# EAGLE design master-board (EAGLE 8.6.0)
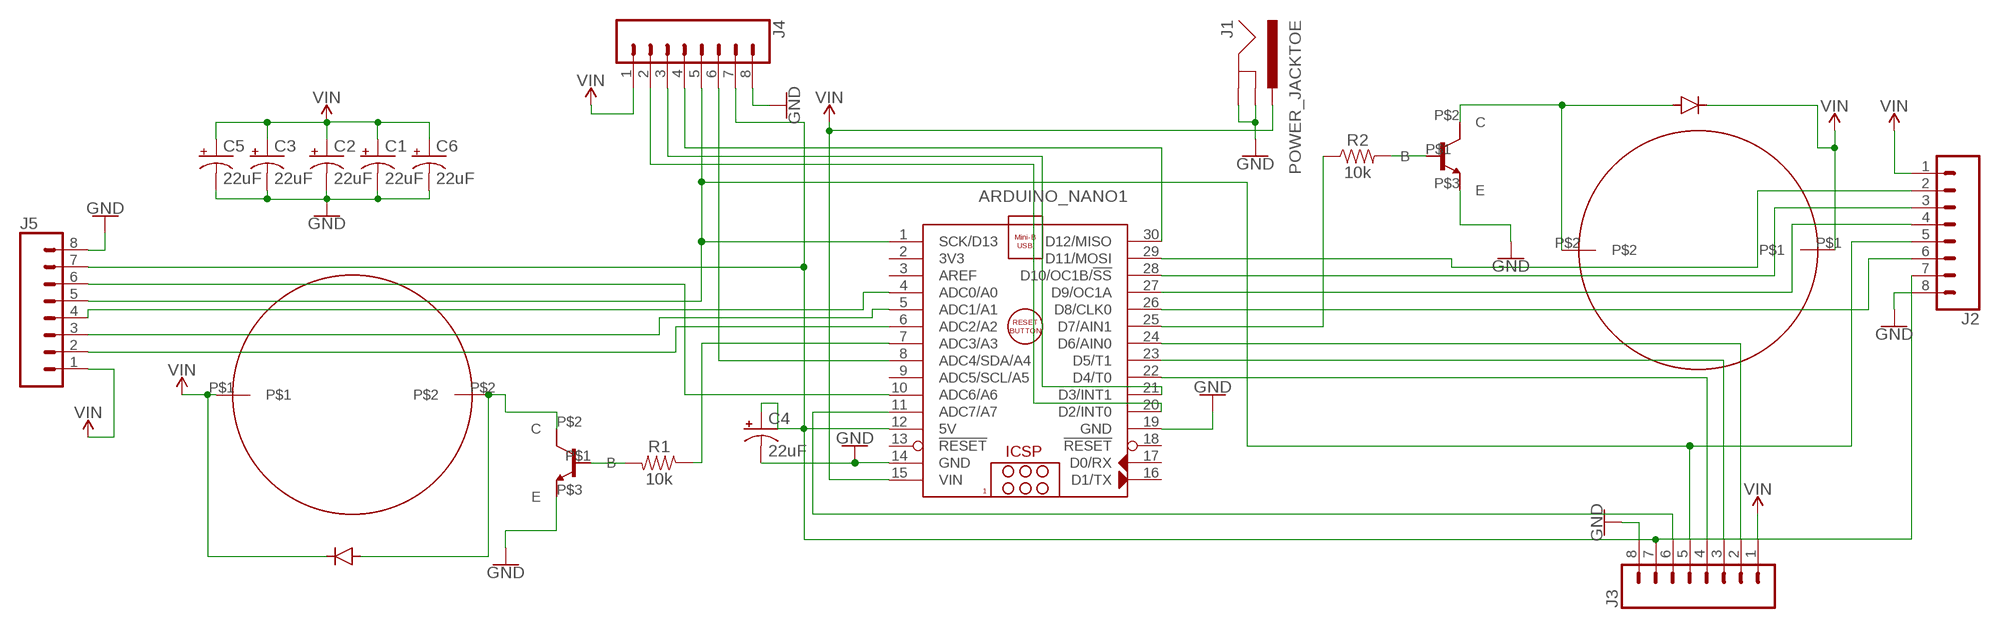
[diagram p0: schematic, sheet 1]

## Parts
ARDUINO_NANO1  ARDUINO_NANO  [ARDUINO_NANO]
C1  22uF  22UF-POLAR-PANASONIC_C-35V-20%  [PANASONIC_C]
C2  22uF  22UF-POLAR-PANASONIC_C-35V-20%  [PANASONIC_C]
C3  22uF  22UF-POLAR-PANASONIC_C-35V-20%  [PANASONIC_C]
C4  22uF  22UF-POLAR-PANASONIC_C-35V-20%  [PANASONIC_C]
C5  22uF  22UF-POLAR-PANASONIC_C-35V-20%  [PANASONIC_C]
C6  22uF  22UF-POLAR-PANASONIC_C-35V-20%  [PANASONIC_C]
J1  POWER_JACKTOE  [POWER_JACK_SMD_OVERPASTE_TOE]
J2  CONN_08"  [1X08]
J3  CONN_08"  [1X08]
J4  CONN_08"  [1X08]
J5  CONN_08"  [1X08]
R1  10k  10KOHM-0603-1/10W-1%  [0603]
R2  10k  10KOHM-0603-1/10W-1%  [0603]
U$1  AIYIMA-PUMP-A5F083  [A5F083]
U$2  AIYIMA-PUMP-A5F083  [A5F083]
U$3  IN4148  [IN4148]
U$4  IN4148  [IN4148]
U$5  TIP120-TO220  [TO220]
U$6  TIP120-TO220  [TO220]

## Nets
GND: ARDUINO_NANO1.14(GND) ARDUINO_NANO1.19(GND) C1.- C2.- C3.- C4.- C5.- C6.- J1.GND(GNDBREAK) J1.P$4(GND) J2.8 J3.8 J4.8 J5.8 U$5.P$3(E) U$6.P$3(E)
N$1: ARDUINO_NANO1.25(D7/AIN1) R2.1
N$2: R1.2 U$6.P$1(B)
N$3: ARDUINO_NANO1.22(D4/T0) J3.4
N$4: ARDUINO_NANO1.23(D5/T1) J3.3
N$5: U$1.P$2 U$3.P$2 U$6.P$2(C)
N$6: U$2.P$2 U$4.P$2 U$5.P$2(C)
N$7: R2.2 U$5.P$1(B)
N$8: ARDUINO_NANO1.21(D3/INT1) J4.3
N$9: ARDUINO_NANO1.24(D6/AIN0) J3.2
N$10: ARDUINO_NANO1.7(ADC3/A3) R1.1
N$11: ARDUINO_NANO1.8(ADC4/SDA/A4) J4.6
N$13: ARDUINO_NANO1.1(SCK/D13) J2.5 J3.5 J4.5 J5.5
N$14: ARDUINO_NANO1.10(ADC6/A6) J5.6
N$15: ARDUINO_NANO1.11(ADC7/A7) J3.6
N$16: ARDUINO_NANO1.20(D2/INT0) J4.2
N$18: ARDUINO_NANO1.30(D12/MISO) J4.4
N$20: ARDUINO_NANO1.12(5V) C4.+ J2.7 J3.7 J4.7 J5.7
N$22: ARDUINO_NANO1.26(D8/CLK0) J2.6
N$23: ARDUINO_NANO1.27(D9/OC1A) J2.4
N$24: ARDUINO_NANO1.28(D10/OC1B/!SS) J2.3
N$25: ARDUINO_NANO1.29(D11/MOSI) J2.2
N$27: ARDUINO_NANO1.6(ADC2/A2) J5.2
N$28: ARDUINO_NANO1.5(ADC1/A1) J5.3
N$29: ARDUINO_NANO1.4(ADC0/A0) J5.4
VIN: ARDUINO_NANO1.15(VIN) C1.+ C2.+ C3.+ C5.+ C6.+ J1.VIN0(PWR) J2.1 J3.1 J4.1 J5.1 U$1.P$1 U$2.P$1 U$3.P$1 U$4.P$1
Unconnected: ARDUINO_NANO1.2(3V3) ARDUINO_NANO1.3(AREF) ARDUINO_NANO1.9(ADC5/SCL/A5) ARDUINO_NANO1.13(!RESET) ARDUINO_NANO1.16(D1/TX) ARDUINO_NANO1.17(D0/RX) ARDUINO_NANO1.18(!RESET)

## Library data of the parts
ARDUINO_NANO1 = ArduinoNanoV30:ARDUINO_NANO: Arduino Nano V3.0 Module Overview: The Arduino Nano is a small, complete, and breadboard-friendly board based on the ATmega328 (Arduino Nano 3.x) or ATmega168 (Arduino Nano 2.x). It has more or less the same functionality of the Arduino Duemilanove, but in a different package. It lacks only a DC power jack, and works with a Mini-B USB cable instead of a standard one. The Nano was designed and is being produced by Gravitech <http://www.gravitech.us/arna30wiatp.html>. General specifications: Item Value Microcontroller Atmel ATmega168 or ATmega328 Operating Voltage (logic level) 5 V Input Voltage (recommended) 7-12 V Input Voltage (limits) 6-20 V Digital I/O Pins 14 (of which 6 provide PWM output) Analog Input Pins 8 DC Current per I/O Pin 40 mA Flash Memory 16 KB (ATmega168) or 32 KB (ATmega328) of which 2 KB used by bootloader SRAM 1 KB (ATmega168) or 2 KB (ATmega328) EEPROM 512 bytes (ATmega168) or 1 KB (ATmega328) Clock Speed 16 MHz Dimensions (Inches) 0.73" x 1.70" Dimensions (mm) 18mm x 45mm Overall height About 9 mm (not including pins) Weigth 5 g Power: The Arduino Nano can be powered via the Mini-B USB connection, 6-20V unregulated external power supply (pin 30), or 5V regulated external power supply (pin 27). The power source is automatically selected to the highest voltage source. Memory: The ATmega168 has 16 KB of flash memory for storing code (of which 2 KB is used for the bootloader); the ATmega328 has 32 KB, (also with 2 KB used for the bootloader). The ATmega168 has 1 KB of SRAM and 512 bytes of EEPROM (which can be read and written with the EEPROM library); the ATmega328 has 2 KB of SRAM and 1 KB of EEPROM. Input and Output: Each of the 14 digital pins on the Nano can be used as an input or output, using pinMode(), digitalWrite(), and digitalRead() functions. They operate at 5 volts. Each pin can provide or receive a maximum of 40 mA and has an internal pull-up resistor (disconnected by default) of 20-50 kOhms. In addition, some pins have specialized functions. Visit Arduino - ArduinoBoardNano <https://www.arduino.cc/en/Main/ArduinoBoardNano>
C1-C6 = SparkFun-Capacitors:22UF-POLAR: 22µF polarized capacitors A capacitor is a passive two-terminal electrical component used to store electrical energy temporarily in an electric field.; PROD_ID: CAP-08618
J1 = SparkFun-Connectors:POWER_JACK: Power Jack Connector This is the standard 5.5mm barrel jack for power. The PTH is the most common, proven, reliable, footprint. The Slot footprint only works if the mill layer is transmitted to the PCB fab house so be warned. Here are the connectors we sell at SparkFun: DC Barrel Power Jack/Connector <https://www.sparkfun.com/products/119> (PRT-00119) DC Barrel Power Jack/Connector (SMD) <https://www.sparkfun.com/products/12748> (PRT-12748) DC Barrel Jack Adapter - Breadboard Compatible <https://www.sparkfun.com/products/10811> (PRT-10811) It is used on this SparkFun product (and many, many others): SparkFun RedBoard - Programmed with Arduino <https://www.sparkfun.com/products/12757> (DEV-12757) Also, if you need a mating power supply or connector, please check these out: Wall Adapter Power Supply - 9VDC 650mA <https://www.sparkfun.com/products/298> (TOL-00298) DC Barrel Jack Adapter - Male <https://www.sparkfun.com/products/10287> (PRT-10287); PROD_ID: CONN-08106; SF_ID: PRT-12748
J2-J5 = SparkFun-Connectors:CONN_08: Multi connection point. Often used as Generic Header-pin footprint for 0.1 inch spaced/style header connections On any of the 0.1 inch spaced packages, you can populate with these: Break Away Headers - Straight <https://www.sparkfun.com/products/116> (PRT-00116) Break Away Male Headers - Right Angle <https://www.sparkfun.com/products/553> (PRT-00553) Female Headers <https://www.sparkfun.com/products/115> (PRT-00115) Break Away Headers - Machine Pin <https://www.sparkfun.com/products/117> (PRT-00117) Break Away Female Headers - Swiss Machine Pin <https://www.sparkfun.com/products/743> (PRT-00743) Arduino Stackable Header - 8 Pin <https://www.sparkfun.com/products/9279> (PRT-09279) For SCREWTERMINALS and SPRING TERMINALS visit here: Screw Terimnals on SparkFun.com <https://www.sparkfun.com/search/results?term=Screw+Terminals> (5mm/3.5mm/2.54mm spacing) This device is also useful as a general connection point to wire up your design to another part of your project. Our various solder wires solder well into these plated through hole pads. Hook-Up Wire - Assortment (Stranded, 22 AWG) <https://www.sparkfun.com/products/11375> (PRT-11375) Hook-Up Wire - Assortment (Solid Core, 22 AWG) <https://www.sparkfun.com/products/11367> (PRT-11367) View the entire wire category on our website here <https://www.sparkfun.com/categories/141> Special notes: Molex polarized connector foot print use with SKU : PRT-08231 with associated crimp pins and housings. 1MM SMD Version SKU: PRT-10208 NOTES ON THE VARIANTS LOCK and LOCK_LONGPADS... This footprint was designed to help hold the alignment of a through-hole component (i.e. 6-pin header) while soldering it into place. You may notice that each hole has been shifted either up or down by 0.005 of an inch from it's more standard position (which is a perfectly straight line). This slight alteration caused the pins (the squares in the middle) to touch the edges of the holes. Because they are alternating, it causes a "brace" to hold the component in place. 0.005 has proven to be the perfect amount of "off-center" position when using our standard breakaway headers. Although looks a little odd when you look at the bare footprint, once you have a header in there, the alteration is very hard to notice. Also,if you push a header all the way into place, it is covered up entirely on the bottom side.; PROD_ID: CONN-08438
R1 R2 = SparkFun-Resistors:10KOHM: 10kΩ resistor A resistor is a passive two-terminal electrical component that implements electrical resistance as a circuit element. Resistors act to reduce current flow, and, at the same time, act to lower voltage levels within circuits. - Wikipedia; PROD_ID: RES-00824
U$1 U$2 = programmable-air-components:AIYIMA-PUMP-A5F083: Aiyima company vacuum/high pressure air pump. 12V, 0.35A, 3LPM
U$3 U$4 = programmable-air-components:IN4148
U$5 U$6 = programmable-air-components:TIP120-TO220

## Board
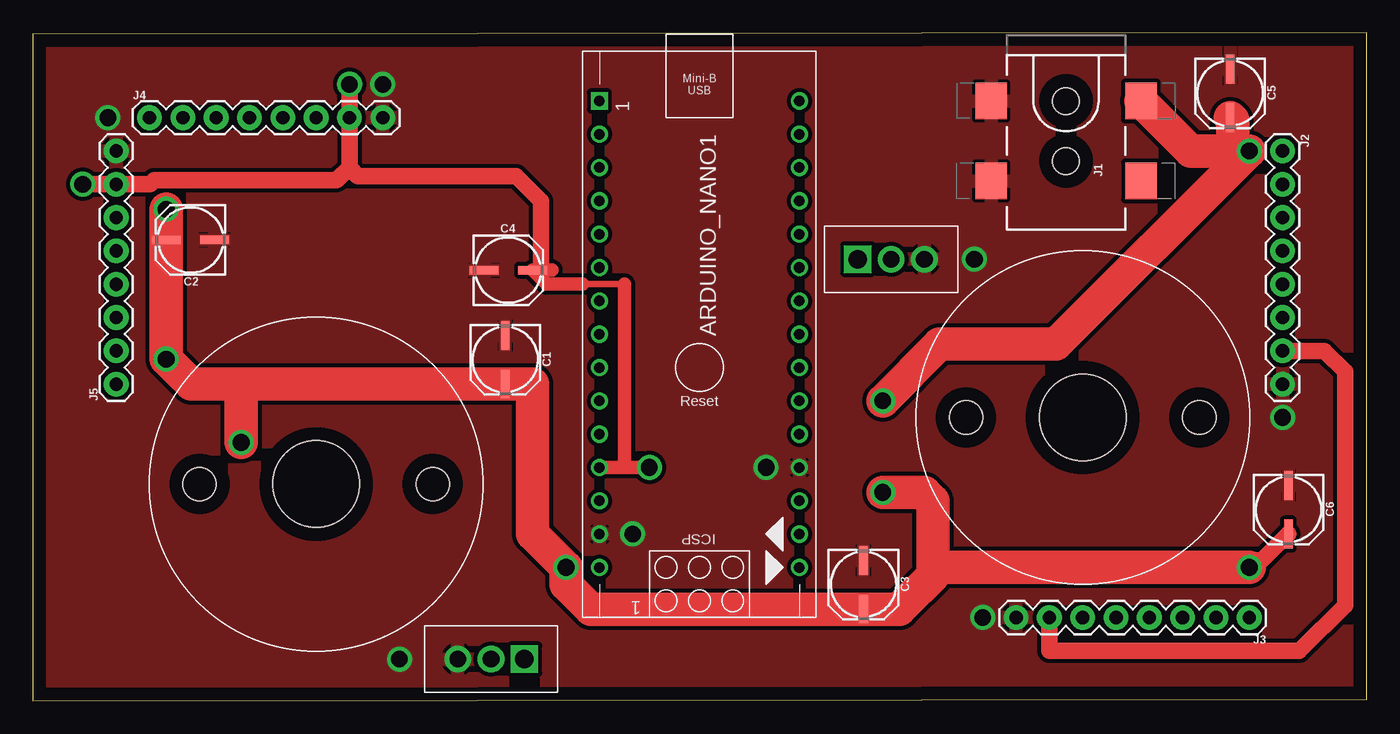
[diagram p1: board, top side]
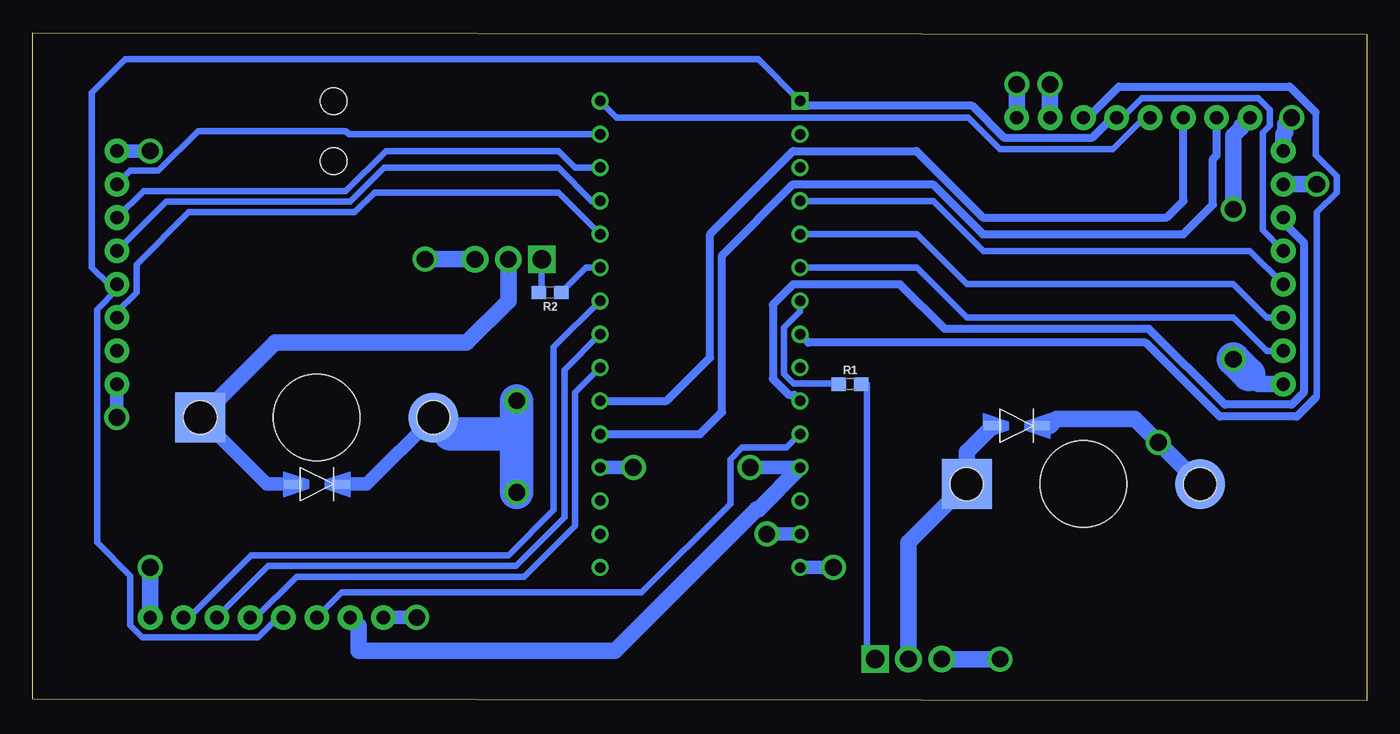
[diagram p2: board, bottom side, seen from below]

Size 101.65 x 50.92 mm. Coordinates in mm from the lower left corner, seen from the top.
Outline: 0,0 101.65,0.13 101.65,50.92 0,50.79 0,0
Copper layers (1*16): Top 0.035mm / dielectric 1.5mm / Bottom 0.035mm
Design rules "default *": minimum track width 6mil, minimum drill 0.35mm, track to track 12mil, track to pad 12mil, pad to pad 12mil, via to via 12mil, smd to smd 12mil, copper to edge 40mil, drill to drill 6mil, minimum pad ring 10mil, minimum via ring 8mil, stop-mask expansion 4mil, vias tented up to drill 0mil, thermal gap 10mil

### Footprints (pad centres in the part's own frame; a part is rotated, then mirrored left to right if it is on the bottom)
ARDUINO_NANO = drill 0.8 square: 1 -20.32,-7.62 | drill 0.8: 2 -17.78,-7.62; 3 -15.24,-7.62; 4 -12.7,-7.62; 5 -10.16,-7.62; 6 -7.62,-7.62; 7 -5.08,-7.62; 8 -2.54,-7.62; 9 0,-7.62; 10 2.54,-7.62; 11 5.08,-7.62; 12 7.62,-7.62; 13 10.16,-7.62; 14 12.7,-7.62; 15 15.24,-7.62; 16 15.24,7.62; 17 12.7,7.62; 18 10.16,7.62; 19 7.62,7.62; 20 5.08,7.62; 21 2.54,7.62; 22 0,7.62; 23 -2.54,7.62; 24 -5.08,7.62; 25 -7.62,7.62; 26 -10.16,7.62; 27 -12.7,7.62; 28 -15.24,7.62; 29 -17.78,7.62; 30 -20.32,7.62
PANASONIC_C = smd 2.2 x 0.65: + 1.9,-0.2; - -1.8,-0.2
POWER_JACK_SMD_OVERPASTE_TOE = smd 2.8 x 2.4: GND 0,-5.7; P$4 6.1,-5.7; VIN0 0,5.7; VIN1 6.1,5.7 | hole 2.032: 0,0; 4.572,0
1X08 = drill 1.016 pad 1.88: 1 0,0; 2 2.54,0; 3 5.08,0; 4 7.62,0; 5 10.16,0; 6 12.7,0; 7 15.24,0; 8 17.78,0
0603 = smd 1.1 x 1: 1 -0.85,0; 2 0.85,0
A5F083 = smd 3.81 x 3.81 bottom: P$1 -8.89,0; P$2 8.89,0 | hole 6.604: 0,0 | hole 2.54: -8.89,0; 8.89,0
IN4148 = smd 1.422 x 0.711: P$1 1.829,0; P$2 -1.829,0
TO220 = drill 1.397 pad 2.032 square: P$1 -2.54,0 | drill 1.27 pad 2.032: P$2 0,0; P$3 2.54,0

### Placement (x,y rotation side)
ARDUINO_NANO1  50.8,25.4 270 top
C1  36.2,26.04 270 top
C2  12.06,34.92 180 top
C3  63.5,8.89 270 top
C4  36.2,33.02 0 top
C5  91.44,46.35 270 top
C6  95.89,14.61 270 top
J1  78.74,45.72 270 top
J2  95.25,41.91 270 top
J3  92.71,6.35 180 top
J4  8.89,44.45 0 top
J5  6.35,24.13 90 top
R1  39.37,24.13 0 bottom
R2  62.23,31.11 180 bottom
U$1  21.59,16.51 0 top
U$2  80.01,21.59 0 top
U$3  26.67,20.95 0 bottom
U$4  80.01,16.51 0 bottom
U$5  65.41,33.66 0 top
U$6  34.92,3.17 180 top

### Tracks (layer width: path | path; a pad name or v marks a point on that pad's centre or on a via)
GND  (via drill 1.27)
  Bottom 1.016: v72.39,6.35 J3.8 | v45.72,12.7 ARDUINO_NANO1.14 | v55.88,17.78 ARDUINO_NANO1.19 | J2.8 v95.25,21.59
  Bottom 1.27: J5.8 6.35,43.18 6.2,43.34 6.2,43.97 v5.71,44.45 | J4.8 v26.67,46.99 | U$6.P$3 v27.94,3.17 | U$5.P$3 v71.75,33.66
  pour Top: 0,50.8 101.6,50.8 101.6,0 0,0
N$1
  Bottom 0.508: R2.1 59.48,33.02 ARDUINO_NANO1.25
N$2
  Bottom 0.508: R1.2 38.1,24.13 38.1,3.17 U$6.P$1
N$3
  Bottom 0.508: ARDUINO_NANO1.22 60.33,23.5 60.33,13.34 64.2,9.46 81.56,9.46 84.67,6.35 J3.4
N$4
  Bottom 0.508: ARDUINO_NANO1.23 61.14,25.22 61.14,13.97 64.83,10.27 83.71,10.27 J3.3
N$5
  Bottom 1.27: U$1.P$2 31.19,16.51 | U$1.P$2 30.48,18.97 U$3.P$2 | U$1.P$2 34.92,12.06 U$6.P$2
N$6
  Bottom 1.016: U$2.P$2 83.82,16.51 U$4.P$2
  Bottom 1.27: U$2.P$2 83.19,27.3 68.58,27.3 65.41,30.48 U$5.P$2
N$7
  Bottom 0.508: U$5.P$1 62.87,31.33 R2.2
N$8
  Bottom 0.61: ARDUINO_NANO1.21 53.34,22.86 50.04,26.16 50.04,35.57 43.7,41.9 34.31,41.9 29.24,36.83 15.24,36.83 13.97,38.1 J4.3
N$9
  Bottom 0.508: ARDUINO_NANO1.24 61.95,26.95 61.95,14.54 65.41,11.09 85.01,11.09 89.75,6.35 J3.2
N$10
  Bottom 0.508: ARDUINO_NANO1.7 43.18,29.66 44.39,28.44 44.39,24.9 43.68,24.19 40.28,24.19 R1.1
N$11
  Bottom 0.508: 3.89,44.83 3.89,41.58 2.3,40 2.3,38.74 3.81,37.23 3.81,23.19 3.89,23.11
  Bottom 0.61: 3.89,23.11 5.34,21.65 11.19,21.65 16.84,27.3 42.55,27.3 ARDUINO_NANO1.8 | J4.6 21.24,44.45 18.88,46.81 5.87,46.81 3.89,44.83
N$13
  Bottom 0.508: J4.5 18.63,44.45 17.13,45.95 8.27,45.95 7.39,45.07 7.39,43.83 7.92,43.3 7.92,35.87 J5.5 | J2.5 95.25,31.33 96.76,29.82 96.76,12.07 94.22,9.53 94.22,5.74 93.33,4.85 84.47,4.85 82.97,6.35 J3.5 | ARDUINO_NANO1.1 46.35,48.9 94.61,48.9 97.16,46.35 97.16,33.02 95.89,31.75
  Bottom 0.61: J4.5 19.4,44.45 20.95,42.9 27.6,42.9 30.05,45.35 42.81,45.35 ARDUINO_NANO1.1 | J2.5 95.89,31.75
N$14
  Bottom 0.61: J5.6 6.35,36.48 4.8,34.93 4.8,23.49 5.72,22.57 10.81,22.57 16.59,28.35 32.16,28.35 35.55,31.74 43.7,31.74 45.26,30.19 45.26,24.54 44.04,23.32 43.64,23.32 ARDUINO_NANO1.10
N$15
  Bottom 0.508: J3.6 78.11,8.26 55.24,8.26 48.5,15 48.5,18.41 47.62,19.29 44.21,19.29 ARDUINO_NANO1.11
N$16
  Bottom 0.61: ARDUINO_NANO1.20 50.8,20.32 49.12,22 49.12,33.94 43.7,39.36 33.06,39.36 29.26,35.56 13.97,35.56 11.72,37.81 11.72,41.29 11.43,41.58 J4.2
N$18
  Bottom 0.508: ARDUINO_NANO1.30 57.15,44.45 30.37,44.45 27.95,42.04 19.34,42.04 16.93,44.45 J4.4
N$20  (via drill 1.27)
  Top 0.508: 41.91,31.75 45.09,31.75
  Top 1.016: 39.57,32.82 38.73,32.82 C4.+ 39.16,31.75 41.91,31.75 | 45.09,31.75 45.09,17.78 ARDUINO_NANO1.12 v46.99,17.78
  Top 1.27: 24.13,40.64 23.16,39.67 9.24,39.67 8.94,39.37 J5.7 v3.81,39.37 | 24.13,40.64 24.77,40.01 36.83,40.01 38.73,38.1 38.73,32.82 | J3.7 77.47,3.81 96.52,3.81 100,7.29 100,25.09 98.42,26.67 J2.7 | J4.7 v24.13,46.99 24.13,40.64
  Bottom 1.016: v46.99,17.78 ARDUINO_NANO1.12
  Bottom 1.27: ARDUINO_NANO1.12 46.37,14.59 46.5,14.59 57.29,3.81 76.83,3.81 76.83,5.71 J3.7 | J4.7 v24.13,46.99 | v3.81,39.37 J5.7
N$22
  Bottom 0.508: ARDUINO_NANO1.26 61.59,38.73 75.62,38.73 77.12,37.24 89.76,37.24 93.75,33.25 93.75,31.13 95.25,29.63 J2.6
N$23
  Bottom 0.508: ARDUINO_NANO1.27 59.05,38.1 61.59,40.64 74.87,40.64 77.46,38.05 91.49,38.05 J2.4
N$24
  Bottom 0.508: ARDUINO_NANO1.28 60.33,40.64 61.59,41.91 74.75,41.91 77.79,38.86 93.22,38.86 J2.3
N$25
  Bottom 0.508: ARDUINO_NANO1.29 77.54,43.18 77.79,43.43 89.05,43.43 92.08,40.4 94.22,40.4 J2.2
N$27
  Bottom 0.508: J5.2 7.62,26.67 10.16,29.21 30.48,29.21 34.29,33.02 ARDUINO_NANO1.6
N$28
  Bottom 0.508: J5.3 7.62,29.21 10.16,31.75 30.48,31.75 34.29,35.56 ARDUINO_NANO1.5
N$29
  Bottom 0.508: J5.4 8.89,34.29 29.21,34.29 33.02,38.1 ARDUINO_NANO1.4
VIN  (via drill 1.27)
  Top 0.61: 88.25,41.91 | 73.79,27.31 73.66,27.18 | C2.+ 10.16,34.92 | C1.+ 36.2,24.13
  Top 1.016: 93.35,10.8 v92.71,10.16
  Top 1.27: 86.87,10.16 86.36,10.16 | 66.36,7.3 66.04,6.99 66.03,6.99 C3.+ | C6.+ 93.14,10.16 v92.71,10.16
  Top 2.54: 15.88,24.13 v15.88,19.68 | 15.88,24.13 36.2,24.13 38.1,24.13 38.1,12.7 v40.64,10.16 40.64,8.89 42.55,6.99 66.04,6.99 | 68.58,10.16 86.36,10.16 v92.71,10.16 | v10.16,37.47 10.16,34.92 v10.16,26.04 12.06,24.13 15.88,24.13 | J1.VIN0 88.25,41.91 91.44,41.91 | 91.44,41.91 v92.71,41.91 77.98,27.18 73.66,27.18 69.09,27.18 v64.77,22.86 | 68.58,10.16 68.58,9.53 66.36,7.3 | v64.77,15.88 67.94,15.88 68.58,15.24 68.58,10.16 | C5.+ 91.44,44.26 91.44,41.91
  Bottom 1.016: v92.71,41.91 J2.1 | v40.64,10.16 ARDUINO_NANO1.15 | U$2.P$1 76.2,16.51 U$4.P$1
  Bottom 1.27: J3.1 v92.71,10.16 | U$3.P$1 24.15,20.95 23.64,21.46 17.65,21.46 v15.88,19.68 U$1.P$1 | J4.1 9.55,43.79 9.55,43.67 10.16,43.06 v10.16,37.47 | v10.16,26.04 8.26,24.13 J5.1
  Bottom 2.54: v64.77,15.88 64.77,20.32 | 64.77,20.32 v64.77,22.86 | U$2.P$1 69.85,20.32 64.77,20.32 | 9,24.87 v10.16,26.04